# EAGLE schematic Brain3port (EAGLE 9.3.2)

## Sheet 1 of 2
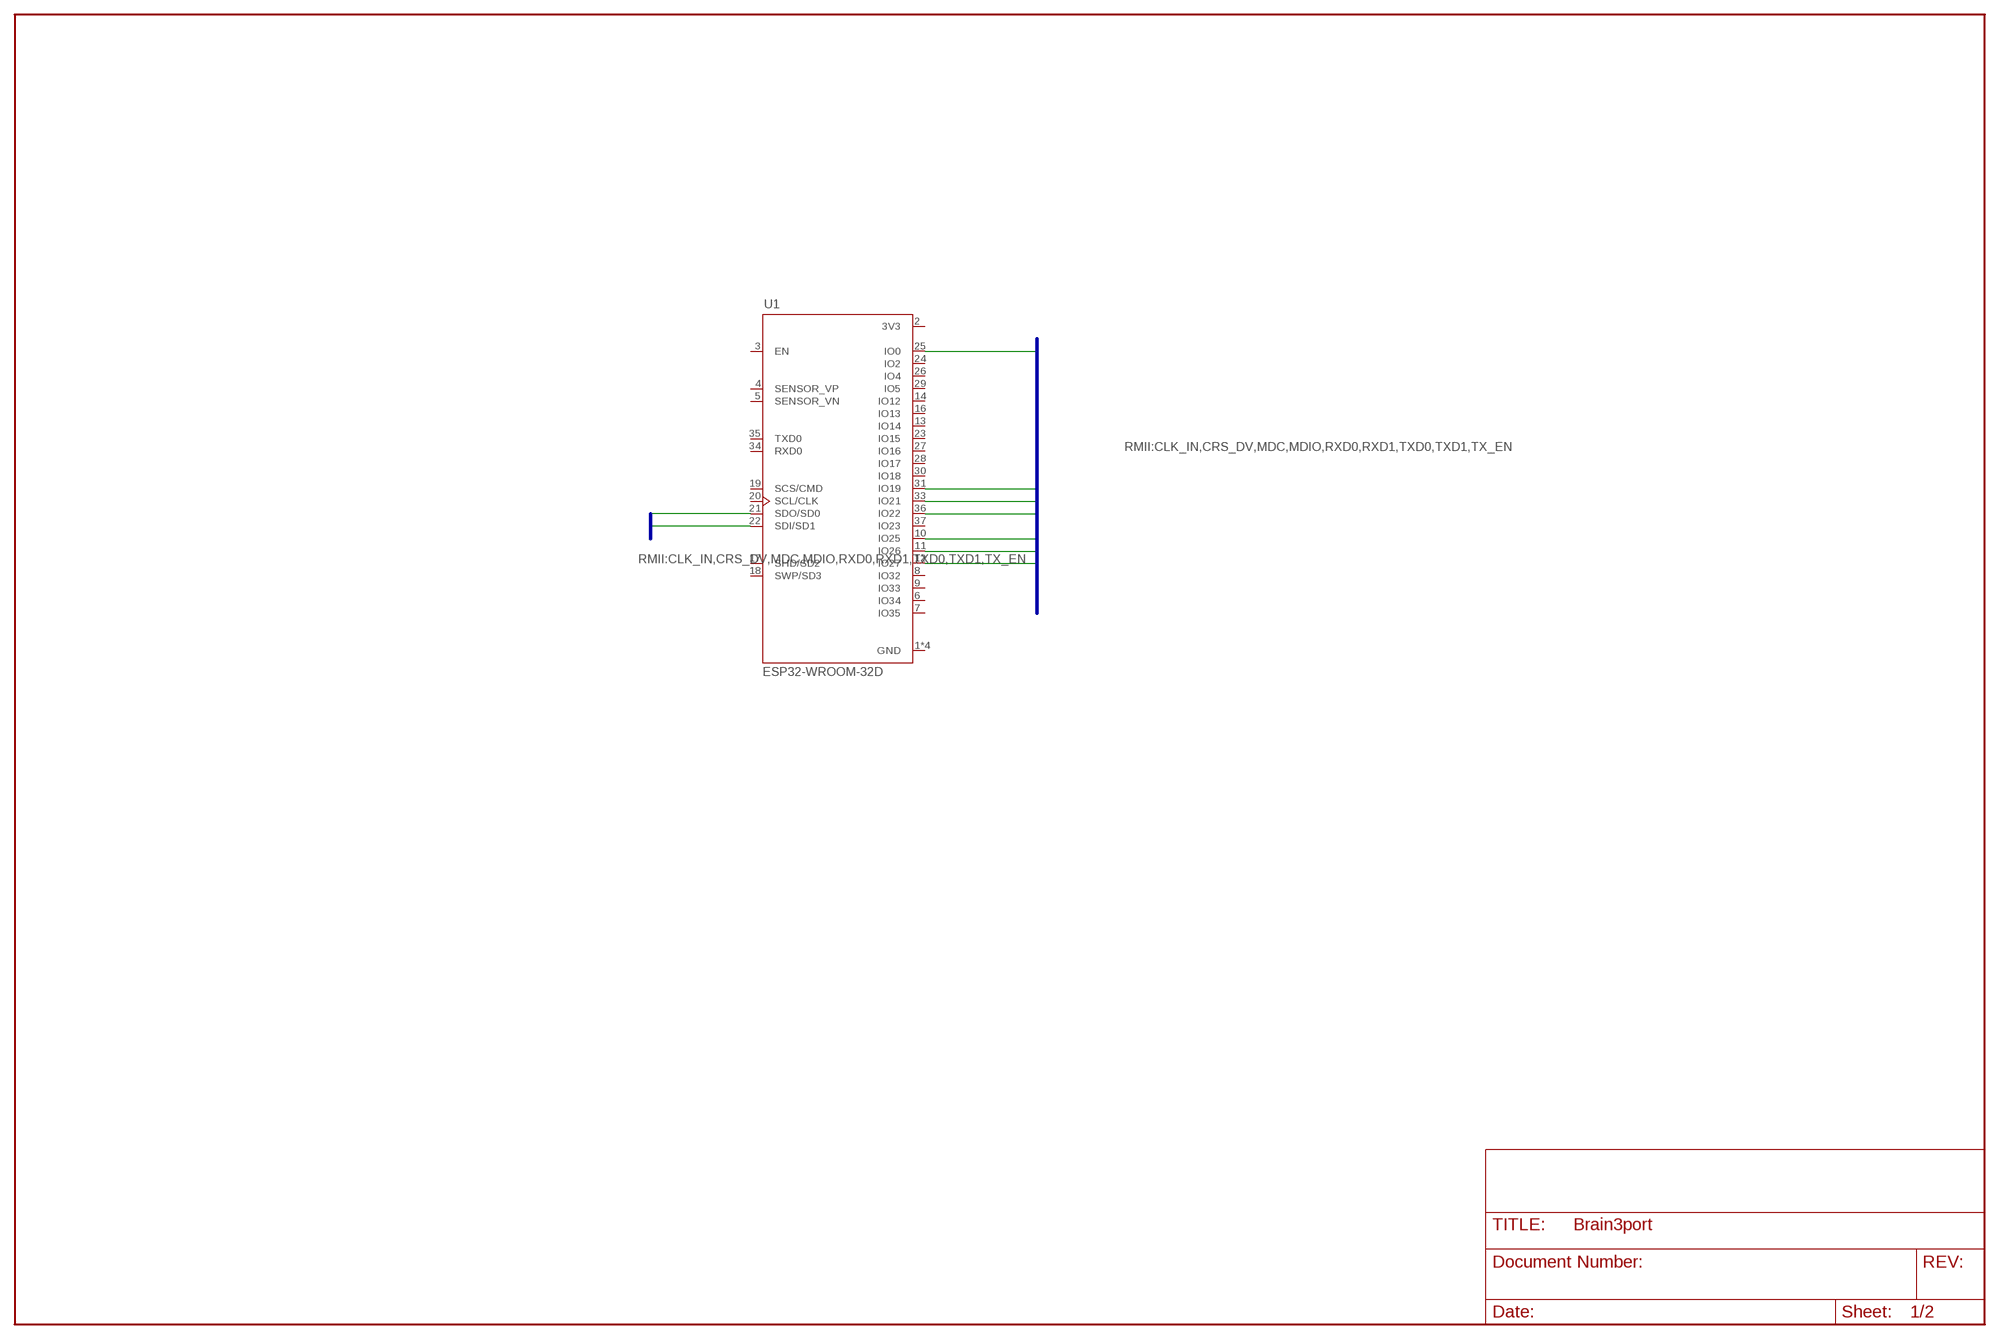
[diagram p0: schematic, sheet 1]

### Parts
U1  ESP32-WROOM-32D  [MODULE_ESP32-WROOM-32D]

### Nets
CLK_IN: U1.25(IO0)
CRS_DV: U1.12(IO27) ; also sheet 2
MDC: U1.21(SDO/SD0)
MDIO: U1.22(SDI/SD1)
RXD0: U1.10(IO25) ; also sheet 2
RXD1: U1.11(IO26) ; also sheet 2
TX_EN: U1.33(IO21) ; also sheet 2
TXD0: U1.31(IO19) ; also sheet 2
TXD1: U1.36(IO22) ; also sheet 2
Unconnected: U1.3(EN) U1.4(SENSOR_VP) U1.5(SENSOR_VN) U1.6(IO34) U1.7(IO35) U1.8(IO32) U1.9(IO33) U1.13(IO14) U1.14(IO12) U1.16(IO13) U1.17(SHD/SD2) U1.18(SWP/SD3) U1.19(SCS/CMD) U1.20(SCL/CLK) U1.23(IO15) U1.24(IO2) U1.26(IO4) U1.27(IO16) U1.28(IO17) U1.29(IO5) U1.30(IO18) U1.34(RXD0) U1.35(TXD0) U1.37(IO23)

### Buses
RMII:CLK_IN,CRS_DV,MDC,MDIO,RXD0,RXD1,TXD0,TXD1,TX_EN

## Sheet 2 of 2
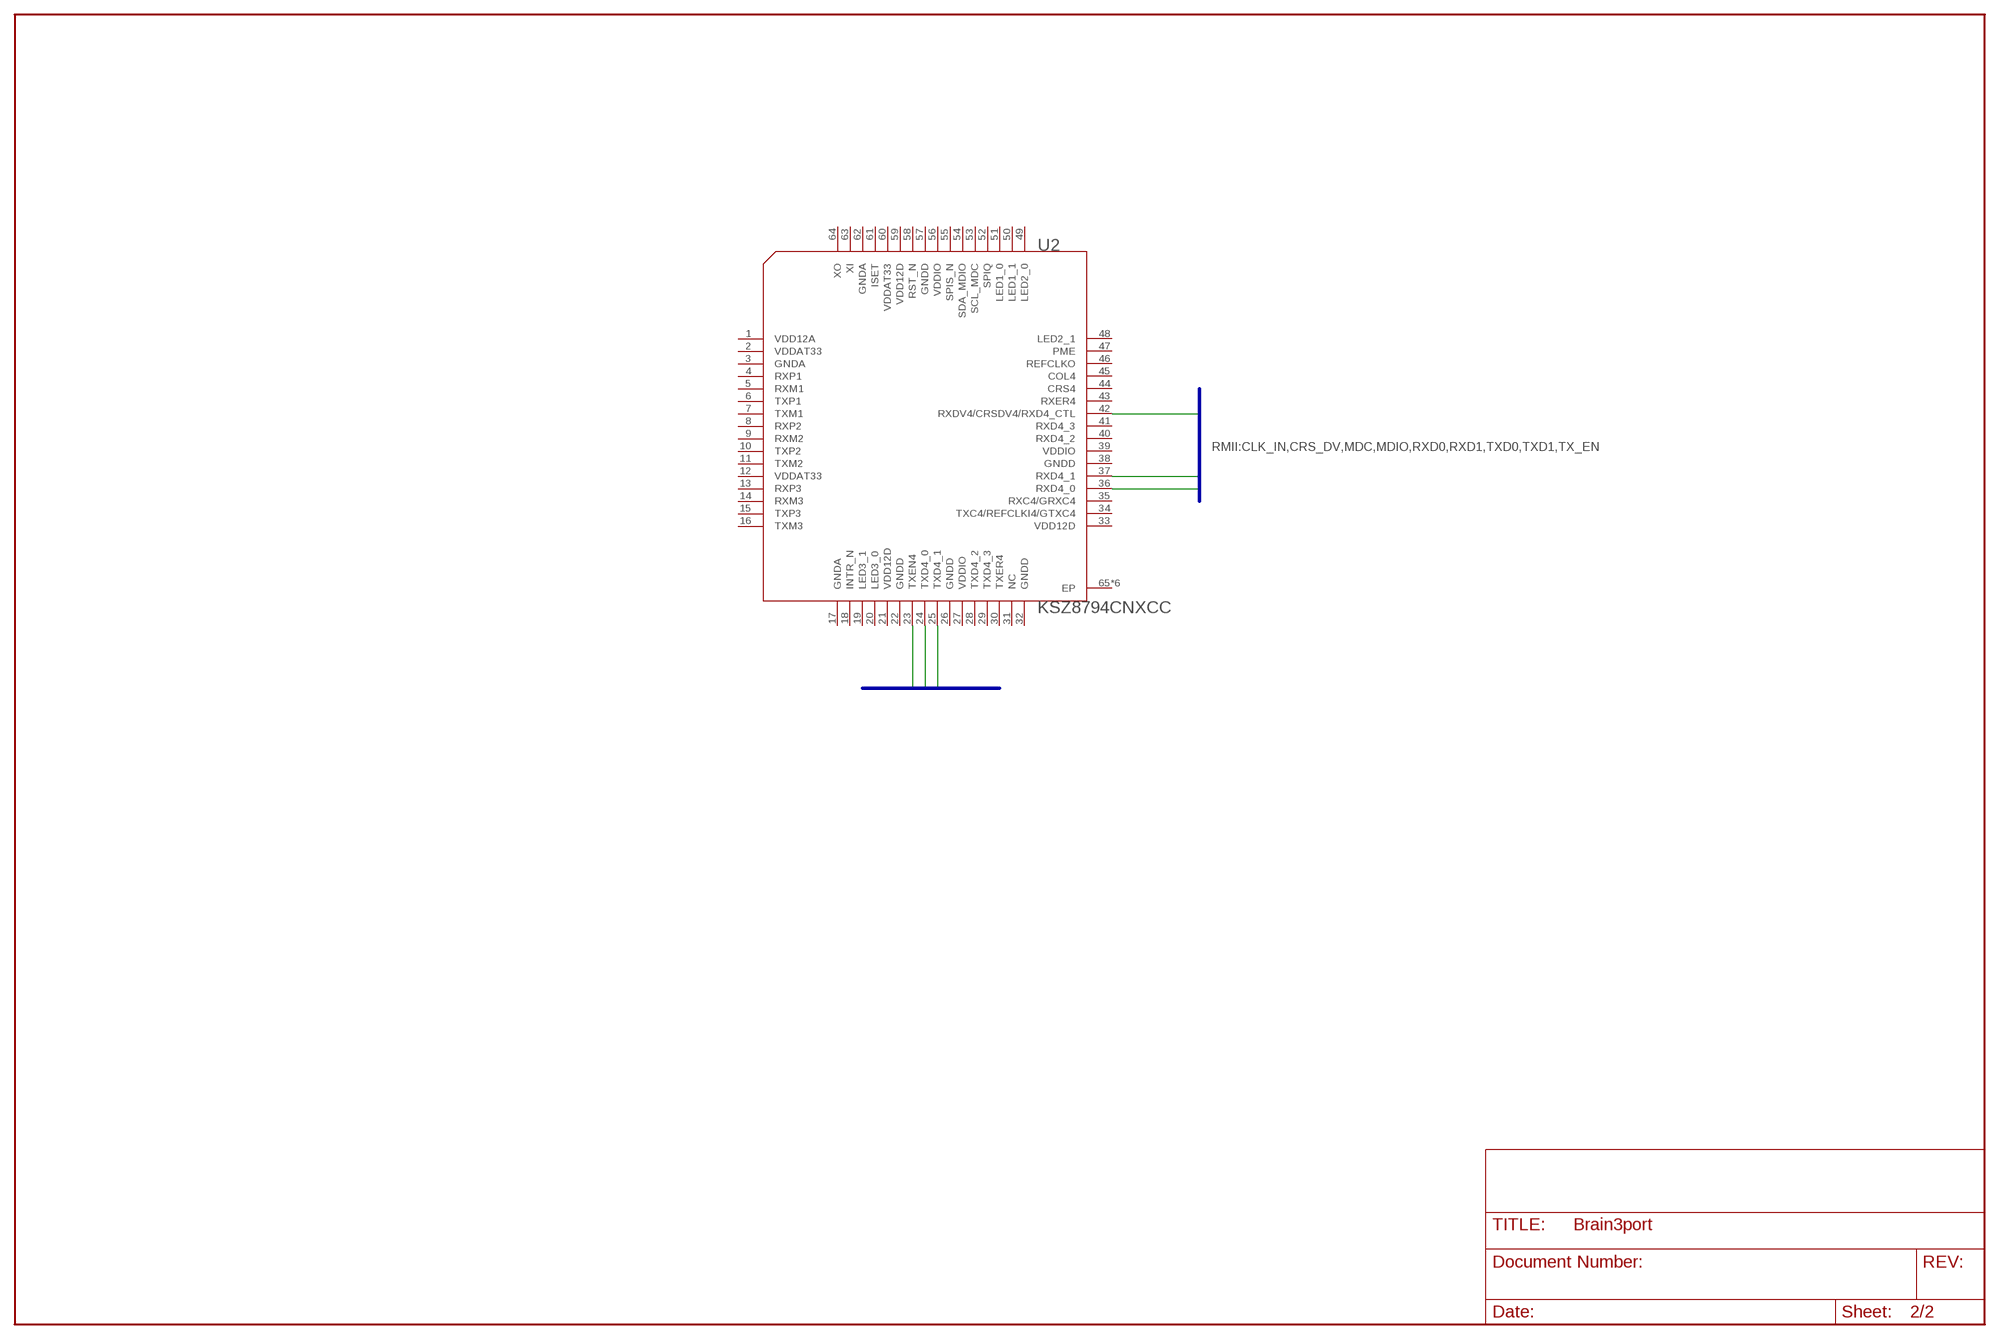
[diagram p1: schematic, sheet 2]

### Parts
U2  KSZ8794CNXCC  [QFN40P800X800X90-65N]

### Nets
CRS_DV: U2.42(RXDV4/CRSDV4/RXD4_CTL) ; also sheet 1
RXD0: U2.36(RXD4_0) ; also sheet 1
RXD1: U2.37(RXD4_1) ; also sheet 1
TX_EN: U2.23(TXEN4) ; also sheet 1
TXD0: U2.24(TXD4_0) ; also sheet 1
TXD1: U2.25(TXD4_1) ; also sheet 1
Unconnected: U2.4(RXP1) U2.5(RXM1) U2.6(TXP1) U2.7(TXM1) U2.8(RXP2) U2.9(RXM2) U2.10(TXP2) U2.11(TXM2) U2.13(RXP3) U2.14(RXM3) U2.15(TXP3) U2.16(TXM3) U2.18(INTR_N) U2.19(LED3_1) U2.20(LED3_0) U2.28(TXD4_2) U2.29(TXD4_3) U2.30(TXER4) U2.31(NC) U2.34(TXC4/REFCLKI4/GTXC4) U2.35(RXC4/GRXC4) U2.40(RXD4_2) U2.41(RXD4_3) U2.43(RXER4) U2.44(CRS4) U2.45(COL4) U2.46(REFCLKO) U2.47(PME) U2.48(LED2_1) U2.49(LED2_0) U2.50(LED1_1) U2.51(LED1_0) U2.52(SPIQ) U2.53(SCL_MDC) U2.54(SDA_MDIO) U2.55(SPIS_N) U2.58(RST_N) U2.61(ISET) U2.63(XI) U2.64(XO) U2.65(EP) U2.P$2(EP) U2.P$3(EP) U2.P$4(EP) U2.P$5(EP) U2.P$6(EP)

### Buses
RMII:CLK_IN,CRS_DV,MDC,MDIO,RXD0,RXD1,TXD0,TXD1,TX_EN

## Power pins joined to a net without a drawn wire
3V3: U1.2(3V3)
GND: U1.1(GND) U1.15(GND) U1.38(GND) U1.39(GND)
GNDA: U2.3(GNDA) U2.17(GNDA) U2.62(GNDA)
GNDD: U2.22(GNDD) U2.26(GNDD) U2.32(GNDD) U2.38(GNDD) U2.57(GNDD)
VDD12A: U2.1(VDD12A)
VDD12D: U2.21(VDD12D) U2.33(VDD12D) U2.59(VDD12D)
VDDAT33: U2.2(VDDAT33) U2.12(VDDAT33) U2.60(VDDAT33)
VDDIO: U2.27(VDDIO) U2.39(VDDIO) U2.56(VDDIO)

## Library data of the parts
U1 = ESP32-WROOM-32D:ESP32-WROOM-32D: IC: SoC; GPIO, I2C, I2S, IR, SD, SDIO, SPI, UART; 2.7÷3.6VDC; 20dBm; DESCRIPTION: IC: SoC; GPIO, I2C, I2S, IR, SD, SDIO, SPI, UART; 2.7÷3.6VDC; 20dBm; DIGI-KEY_PART_NUMBER: 1904-1023-1-ND; DIGI-KEY_PURCHASE_URL: https://www.digikey.com/product-detail/en/espressif-systems/ESP32-WROOM-32D/1904-1023-1-ND/9381732?utm_source=snapeda&utm_medium=aggregator&utm_campaign=symbol; MF: Espressif Systems; MP: ESP32-WROOM-32D; PACKAGE: Module Espressif Systems
U2 = KSZ8794CNXCC:KSZ8794CNXCC: 4-Port 10/100 Switch with RGMII/GMII, 64 VQFN 8x8x0.9mm TRAY; DESCRIPTION: 4-Port 10/100 Switch with RGMII/GMII, 64 VQFN 8x8x0.9mm T/R; DIGI-KEY_PART_NUMBER: KSZ8794CNXCC-CT-ND; DIGI-KEY_PURCHASE_URL: https://www.digikey.com/product-detail/en/microchip-technology/KSZ8794CNXCC-TR/KSZ8794CNXCC-CT-ND/9923662?utm_source=snapeda&utm_medium=aggregator&utm_campaign=symbol; MF: Microchip; MP: KSZ8794CNXCC-TR; PACKAGE: QFN-64 Microchip